# EAGLE design Qwiic_Switch-Gap-0.0320 (EAGLE 9.4.0)
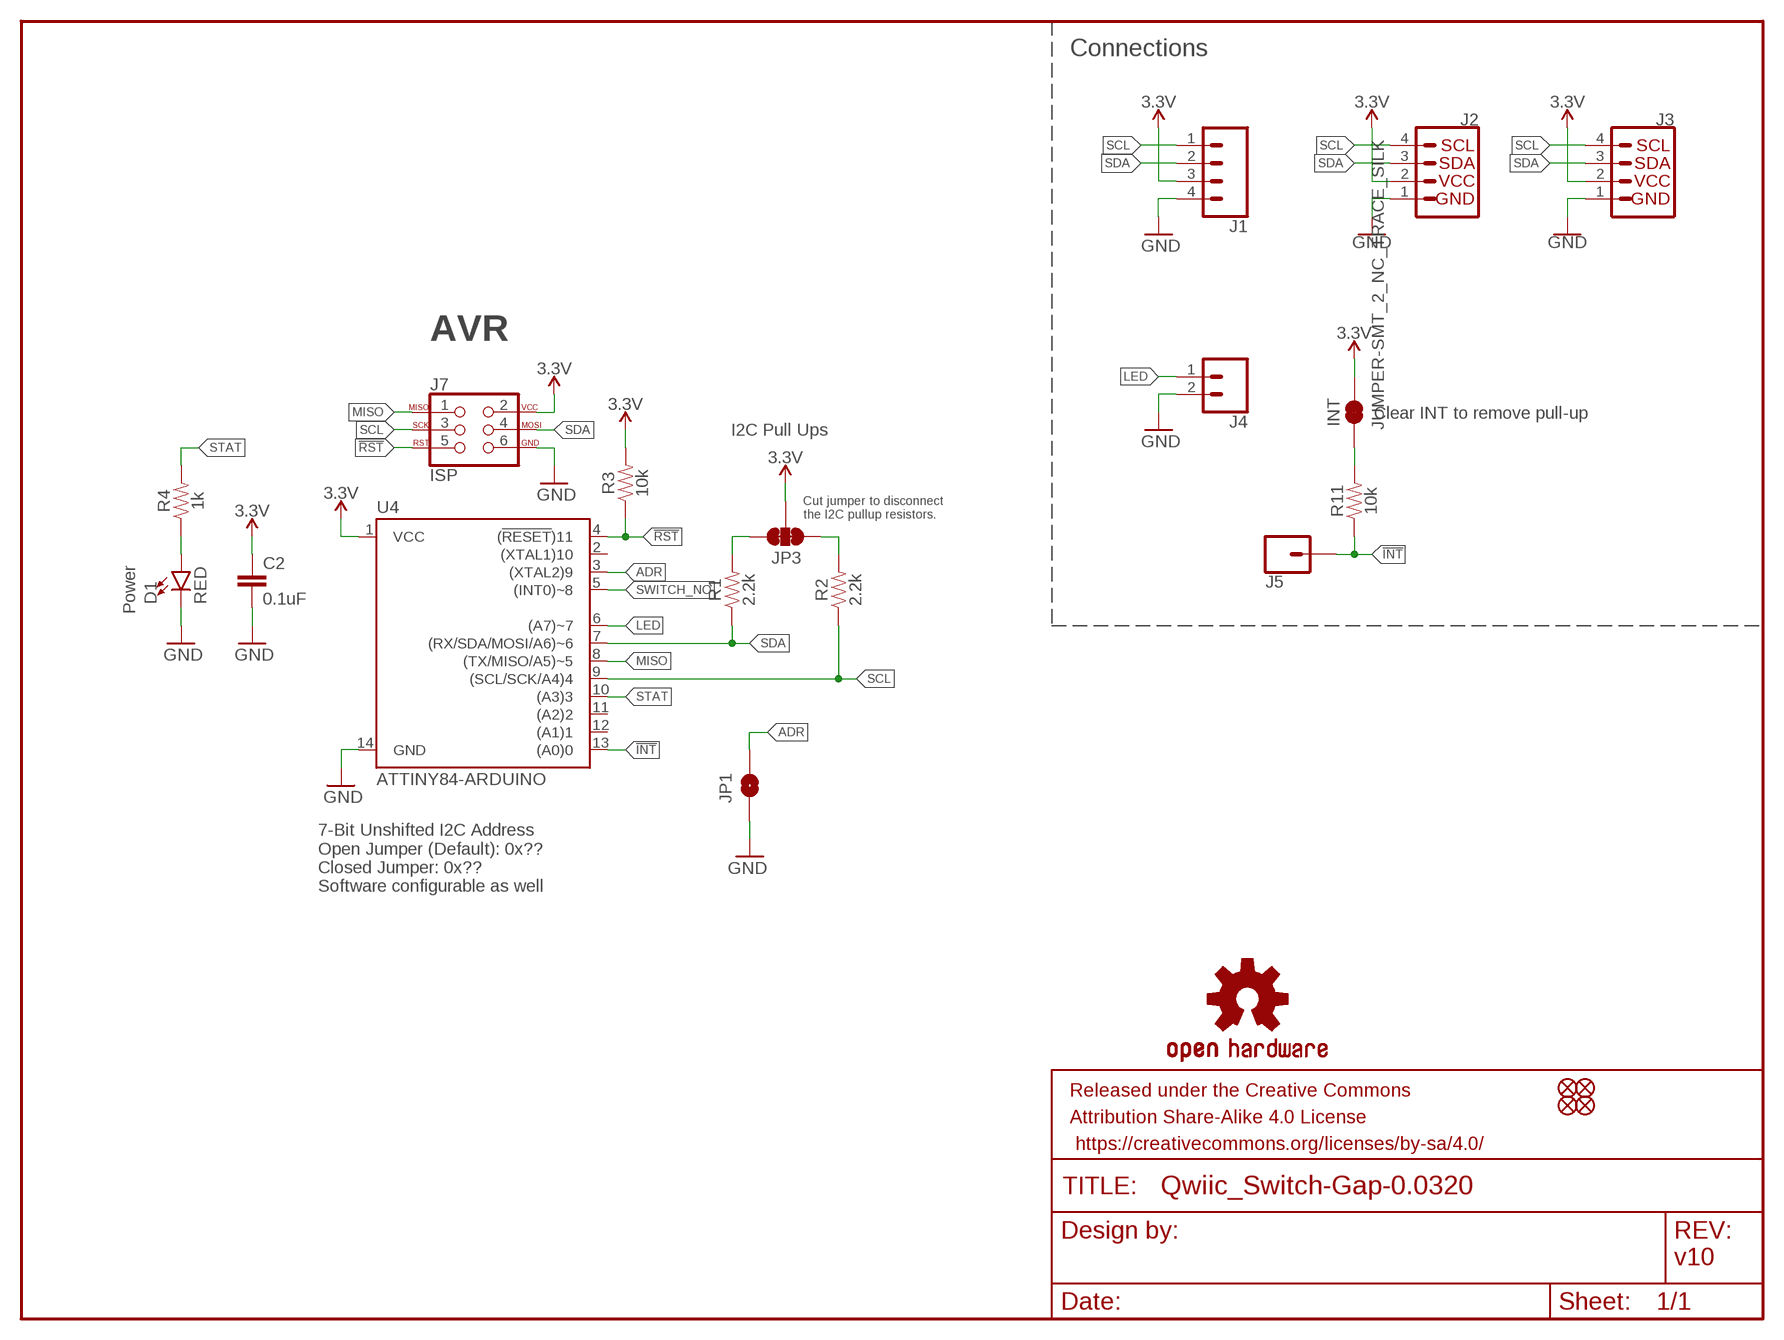
[diagram p0: schematic, sheet 1]

## Parts
C2  0.1uF  0.1UF-0603-25V-(+80/-20%)  [0603]
D1  RED  LED-RED0603  [LED-0603]
FRAME1  FRAME-LETTER  [CREATIVE_COMMONS]
INT  JUMPER-SMT_2_NC_TRACE_SILK  [SMT-JUMPER_2_NC_TRACE_SILK]
J1  CONN_041X04_NO_SILK  [1X04_NO_SILK]
J2  QWIIC_CONNECTORJS-1MM  [JST04_1MM_RA]
J3  QWIIC_CONNECTORJS-1MM  [JST04_1MM_RA]
J4  CONN_021X02_NO_SILK  [1X02_NO_SILK]
J5  CONN_01PTH_NO_SILK_YES_STOP  [1X01_NO_SILK]
J7  ISP  AVR_SPI_PROG_3X2TESTPOINTS  [2X3_TEST_POINTS]
JP1  JUMPER-SMT_2_NO_SILK  [SMT-JUMPER_2_NO_SILK]
JP2  FIDUCIALUFIDUCIAL  [MICRO-FIDUCIAL]
JP3  JUMPER-SMT_3_2-NC_TRACE_SILK  [SMT-JUMPER_3_2-NC_TRACE_SILK]
JP6  FIDUCIALUFIDUCIAL  [MICRO-FIDUCIAL]
JP8  FIDUCIALUFIDUCIAL  [MICRO-FIDUCIAL]
JP9  FIDUCIALUFIDUCIAL  [MICRO-FIDUCIAL]
LOGO1  OSHW-LOGOMINI  [OSHW-LOGO-MINI]
R1  2.2k  2.2KOHM-0603-1/10W-1%  [0603]
R2  2.2k  2.2KOHM-0603-1/10W-1%  [0603]
R3  10k  10KOHM-0603-1/10W-1%  [0603]
R4  1k  1KOHM-0603-1/10W-1%  [0603]
R11  10k  10KOHM-0603-1/10W-1%  [0603]
U4  ATTINY84-ARDUINO  [SO14]

## Nets
3.3V: C2.1 INT.2 J1.3 J2.2 J3.2 J7.2 JP3.2 R3.2 U4.1(VCC)
!INT: J5.1 R11.1 U4.13((A0)0)
!RST: J7.5 R3.1 U4.4((!RESET!)11)
ADR: JP1.2 U4.3((XTAL2)9)
GND: C2.2 D1.C J1.4 J2.1 J3.1 J4.2 J7.6 JP1.1 U4.14(GND)
INT_R: INT.1 R11.2
LED: J4.1 U4.6((A7)~7)
MISO: J7.1 U4.8((TX/MISO/A5)~5)
N$3: D1.A R4.1
SCL: J1.1 J2.4 J3.4 J7.3 R2.1 U4.9((SCL/SCK/A4)4)
SCL_PU1: JP3.1 R2.2
SDA: J1.2 J2.3 J3.3 J7.4 R1.1 U4.7((RX/SDA/MOSI/A6)~6)
SDA_PU1: JP3.3 R1.2
STAT: R4.2 U4.10((A3)3)
SWITCH_NO: U4.5((INT0)~8)
Unconnected: U4.2((XTAL1)10) U4.11((A2)2) U4.12((A1)1)

## Notes on the sheet
- Connections
- AVR
- Clear INT to remove pull-up
- I2C Pull Ups
- Cut jumper to disconnect
  the I2C pullup resistors.
- Power
- 7-Bit Unshifted I2C Address
  Open Jumper (Default): 0x??
  Closed Jumper: 0x??
  Software configurable as well
- v10

## Library data of the parts
C2 = SparkFun-Capacitors:0.1UF: 0.1µF ceramic capacitors A capacitor is a passive two-terminal electrical component used to store electrical energy temporarily in an electric field.; PROD_ID: CAP-00810
D1 = SparkFun-LED:LED-RED: Red SMD LED Used in manufacturing of most products at SparkFun Packages: 0603 - SMD 0603 package [Product Link] <http://docs.avagotech.com/docs/AV02-0551EN> 0603 SMART - SMD 0603 SMART package ( more efficient and expensive)[Product Link] <http://www.osram-os.com/Graphics/XPic2/00077099_0.pdf> 1206 - SMD1206 package [Product Link] <https://www.sparkfun.com/datasheets/DevTools/LilyPad/Q150OVS4.pdff> SparkFun Products: Pro Mini 328 -5V <https://www.sparkfun.com/products/821> RedBoard <https://www.sparkfun.com/products/12757> IOIO-OTG <https://www.sparkfun.com/products/13613>; PROD_ID: DIO-00819
FRAME1 = SparkFun-Aesthetics:FRAME-LETTER: Schematic Frame - Letter Standard 8.5x11 US Letter frame
INT = SparkFun-Jumpers:JUMPER-SMT_2_NC_TRACE: Normally closed trace jumper This jumper has a trace between two pads so it's normally closed (NC). Use a razor knife to open the connection. For best results follow the IPC guidelines for cutting traces: Cutout at least 0.063 mm (0.005 in). Remove all loose material to clean up the cut area. Seal the cut with an approved epoxy. Reapply solder to reclose the connection.
J1 = SparkFun-Connectors:CONN_04: Multi connection point. Often used as Generic Header-pin footprint for 0.1 inch spaced/style header connections On any of the 0.1 inch spaced packages, you can populate with these: Break Away Headers - Straight <https://www.sparkfun.com/products/116> (PRT-00116) Break Away Male Headers - Right Angle <https://www.sparkfun.com/products/553> (PRT-00553) Female Headers <https://www.sparkfun.com/products/115> (PRT-00115) Break Away Headers - Machine Pin <https://www.sparkfun.com/products/117> (PRT-00117) Break Away Female Headers - Swiss Machine Pin <https://www.sparkfun.com/products/743> (PRT-00743) For SCREWTERMINALS and SPRING TERMINALS visit here: Screw Terimnals on SparkFun.com <https://www.sparkfun.com/search/results?term=Screw+Terminals> (5mm/3.5mm/2.54mm spacing) This device is also useful as a general connection point to wire up your design to another part of your project. Our various solder wires solder well into these plated through hole pads. Hook-Up Wire - Assortment (Stranded, 22 AWG) <https://www.sparkfun.com/products/11375> (PRT-11375) Hook-Up Wire - Assortment (Solid Core, 22 AWG) <https://www.sparkfun.com/products/11367> (PRT-11367) View the entire wire category on our website here <https://www.sparkfun.com/categories/141> Special notes: Molex polarized connector foot print use with SKU : PRT-08231 with associated crimp pins and housings. 1MM SMD Version SKU: PRT-10208; PROD_ID: CONN-09696
J2 J3 = SparkFun-Connectors:QWIIC_CONNECTOR: SparkFun I2C Standard Qwiic Connector An SMD 1mm pitch JST connector makes it easy and quick (get it? Qwiic?) to connect I2C devices to each other. The Qwiic system <http://www.sparkfun.com/qwiic> enables fast and solderless connection between popular platforms and various sensors and actuators. We carry 200mm <https://www.sparkfun.com/products/14204>, 100mm <https://www.sparkfun.com/products/14205>, 50mm <https://www.sparkfun.com/products/14206>, and breadboard friendly <https://www.sparkfun.com/products/14207> Qwiic cables. We also offer 10 pcs strips <https://www.sparkfun.com/products/14323> the SMD connectors.; PROD_ID: CONN-13694
J4 = SparkFun-Connectors:CONN_02: Multi connection point. Often used as Generic Header-pin footprint for 0.1 inch spaced/style header connections On any of the 0.1 inch spaced packages, you can populate with these: Break Away Headers - Straight <https://www.sparkfun.com/products/116> (PRT-00116) Break Away Male Headers - Right Angle <https://www.sparkfun.com/products/553> (PRT-00553) Female Headers <https://www.sparkfun.com/products/115> (PRT-00115) Break Away Headers - Machine Pin <https://www.sparkfun.com/products/117> (PRT-00117) Break Away Female Headers - Swiss Machine Pin <https://www.sparkfun.com/products/743> (PRT-00743) For SCREWTERMINALS and SPRING TERMINALS visit here: Screw Terimnals on SparkFun.com <https://www.sparkfun.com/search/results?term=Screw+Terminals> (5mm/3.5mm/2.54mm spacing) This device is also useful as a general connection point to wire up your design to another part of your project. Our various solder wires solder well into these plated through hole pads. Hook-Up Wire - Assortment (Stranded, 22 AWG) <https://www.sparkfun.com/products/11375> (PRT-11375) Hook-Up Wire - Assortment (Solid Core, 22 AWG) <https://www.sparkfun.com/products/11367> (PRT-11367) View the entire wire category on our website here <https://www.sparkfun.com/categories/141> Special notes: Molex polarized connector foot print use with: PRT-08233 with associated crimp pins and housings. 2.54_SCREWTERM for use with PRT-10571. 3.5mm Screw Terminal footprints for PRT-08084 5mm Screw Terminal footprints for use with PRT-08432
J5 = SparkFun-Connectors:CONN_01: Single connection point. Often used as Generic Header-pin footprint for 0.1 inch spaced/style header connections On any of the 0.1 inch spaced packages, you can populate with these: Break Away Headers - Straight <https://www.sparkfun.com/products/116> (PRT-00116) Break Away Male Headers - Right Angle <https://www.sparkfun.com/products/553> (PRT-00553) Female Headers <https://www.sparkfun.com/products/115> (PRT-00115) Break Away Headers - Machine Pin <https://www.sparkfun.com/products/117> (PRT-00117) Break Away Female Headers - Swiss Machine Pin <https://www.sparkfun.com/products/743> (PRT-00743) This device is also useful as a general connection point to wire up your design to another part of your project. Our various solder wires solder well into these plated through hole pads. Hook-Up Wire - Assortment (Stranded, 22 AWG) <https://www.sparkfun.com/products/11375> (PRT-11375) Hook-Up Wire - Assortment (Solid Core, 22 AWG) <https://www.sparkfun.com/products/11367> (PRT-11367) View the entire wire category on our website here <https://www.sparkfun.com/categories/141> Special notes: SMTSO-256-ET is a "flush mount" nut for a 4-40 screw. We mostly use this on specialty testbeds; it is a nice way to connect hardware to your PCB at an adjustable hieght. Also note, the SNAP packages are for using a snappable style connector. We sell a baggie of snaps and they are also used on two LilyPad designs: Snap Assortment - 30 pack (male and female) <https://www.sparkfun.com/products/11347> (DEV-11347) LilyPad Arduino SimpleSnap <https://www.sparkfun.com/products/10941> (DEV-10941) LilyPad SimpleSnap Protoboard <https://www.sparkfun.com/products/10940> (DEV-10940)
J7 = SparkFun-Connectors:AVR_SPI_PROG_3X2: AVR ISP 6 Pin This is the reduced ISP connector for AVR programming. Common on Arduino. This footprint will take up less PCB space and can be used with a 10-pin to 6-pin adapter such as SKU: BOB-08508 **Special note about "TEST_POINT" package. The stop mask is on the top side, so if you want your programming test points to be on the bottom of your board, make sure to place this package on the bottom side of the board. This also ensure that the orientation to program from the bottom side will be correct. SparkFun Products: SparkFun ISP Pogo Adapter <https://www.sparkfun.com/products/11591> - NS Tiny AVR Programmer <https://www.sparkfun.com/products/11801> -PTH
JP1 = SparkFun-Jumpers:JUMPER-SMT_2_NO: Normally open jumper This jumper has two pads in close proximity to each other. Apply solder to close the connection. Round pads are easier to solder for beginners, but are a lot larger. SparkFun Product that uses the round pads: SparkFun EL Sequencer <https://www.sparkfun.com/products/12781>
JP2 JP6 JP8 JP9 = SparkFun:FIDUCIAL: Fiducial Alignment Points Various fiducial points for machine vision alignment.
JP3 = SparkFun-Jumpers:JUMPER-SMT_3_2-NC_TRACE: Normally closed trace jumper (2 of 2 connections) This jumper has a trace between all three pads so they are normally closed (NC). Use a razor knife to open the connection(s). For best results follow the IPC guidelines for cutting traces: Cutout at least 0.063 mm (0.005 in). Remove all loose material to clean up the cut area. Seal the cut with an approved epoxy. Reapply solder to reclose the connection(s).
LOGO1 = SparkFun-Aesthetics:OSHW-LOGO: Open-Source Hardware (OSHW) Logo This logo indicates the piece of hardware it is found on incorporates a OSHW license and/or adheres to the definition of open source hardware found here: http://freedomdefined.org/OSHW
R1 R2 = SparkFun-Resistors:2.2KOHM: 2.2kΩ resistor A resistor is a passive two-terminal electrical component that implements electrical resistance as a circuit element. Resistors act to reduce current flow, and, at the same time, act to lower voltage levels within circuits. - Wikipedia; PROD_ID: RES-08272
R3 R11 = SparkFun-Resistors:10KOHM: 10kΩ resistor A resistor is a passive two-terminal electrical component that implements electrical resistance as a circuit element. Resistors act to reduce current flow, and, at the same time, act to lower voltage levels within circuits. - Wikipedia; PROD_ID: RES-00824
R4 = SparkFun-Resistors:1KOHM: 1kΩ resistor A resistor is a passive two-terminal electrical component that implements electrical resistance as a circuit element. Resistors act to reduce current flow, and, at the same time, act to lower voltage levels within circuits. - Wikipedia; PROD_ID: RES-07856
U4 = SparkFun-IC-Microcontroller:ATTINY84-ARDUINO; PROD_ID: IC-14155

## Board
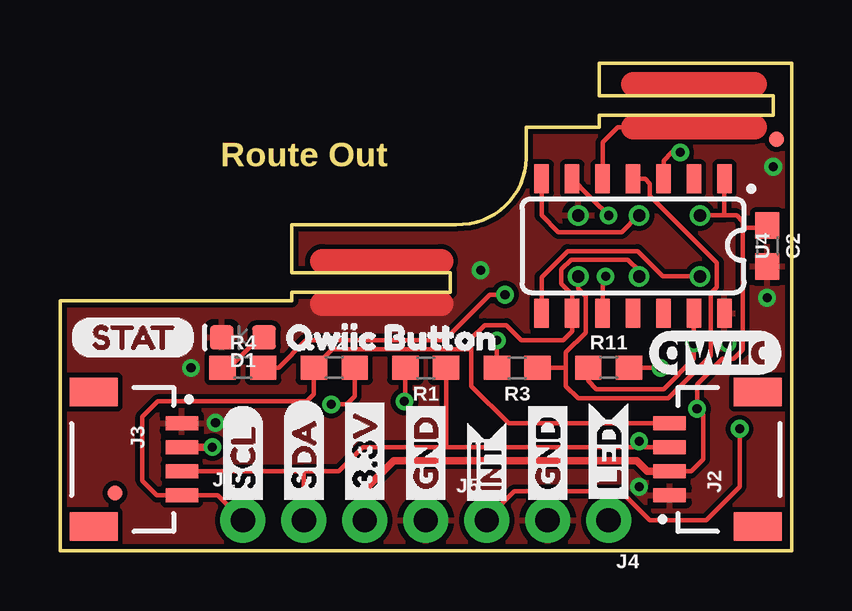
[diagram p1: board, top side]
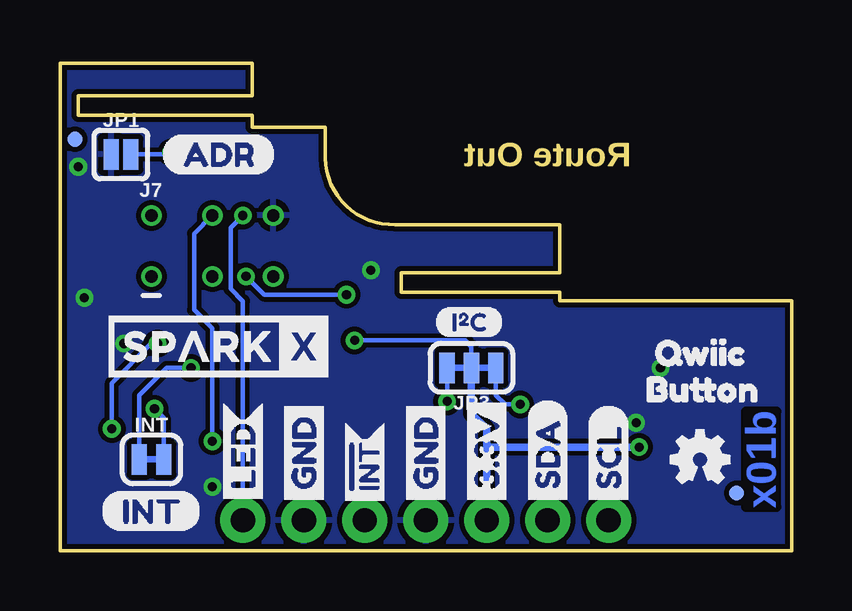
[diagram p2: board, bottom side, seen from below]

Size 30.48 x 20.32 mm. Coordinates in mm from the lower left corner, seen from the top.
Outline: 0,0 30.48,0 30.48,20.32 22.48,20.32 22.48,18.95 29.72,18.95 29.72,18.14 22.48,18.14 22.48,17.65 19.43,17.65 19.43,16.64 arc-96 16.51,13.59 9.65,13.59 9.65,11.58 16.26,11.58 16.26,10.77 9.65,10.77 9.65,10.41 0,10.41 0,0
Copper layers (1*16): Top 0.035mm / dielectric 1.5mm / Bottom 0.035mm
Design rules "SparkFun-2-layer-TIGHT": minimum track width 7mil, minimum drill 15mil, track to track 7mil, track to pad 7mil, pad to pad 7mil, via to via 7mil, smd to smd 7mil, copper to edge 7mil, drill to drill 7mil, minimum pad ring 7mil, minimum via ring 7mil, stop-mask expansion 4mil, vias tented up to drill 25mil, thermal gap 10mil

### Footprints (pad centres in the part's own frame; a part is rotated, then mirrored left to right if it is on the bottom)
0603 = smd 1.1 x 1: 1 -0.85,0; 2 0.85,0
LED-0603 = smd 1 x 1: A -0.877,0; C 0.877,0
SMT-JUMPER_2_NC_TRACE_SILK = smd 0.635 x 1.27: 1 -0.508,0; 2 0.508,0
1X04_NO_SILK = drill 1.016 pad 1.88: 1 0,0; 2 2.54,0; 3 5.08,0; 4 7.62,0
JST04_1MM_RA = smd 0.6 x 1.35: 1 -1.5,0; 2 -0.5,0; 3 0.5,0; 4 1.5,0 | smd 1.2 x 2: NC1 2.8,-3.675; NC2 -2.8,-3.675
1X02_NO_SILK = drill 1.016 pad 1.88: 1 0,0; 2 2.54,0
1X01_NO_SILK = drill 1.016 pad 1.88: 1 0,0
2X3_TEST_POINTS = drill 0.508: 1 -2.54,-1.27; 2 -2.54,1.27; 3 0,-1.27; 4 0,1.27; 5 2.54,-1.27; 6 2.54,1.27
SMT-JUMPER_2_NO_SILK = smd 0.635 x 1.27: 1 -0.406,0; 2 0.406,0
MICRO-FIDUCIAL = smd 0.635 x 0.635: 1 0,0
SMT-JUMPER_3_2-NC_TRACE_SILK = smd 0.635 x 1.27: 1 -1.016,0; 2 0,0; 3 1.016,0
SO14 = smd 0.6 x 1.2: 1 -3.175,-2.8; 2 -1.905,-2.8; 3 -0.635,-2.8; 4 0.635,-2.8; 5 1.905,-2.8; 6 3.175,-2.8; 7 4.445,-2.8; 8 4.445,2.8; 9 3.175,2.8; 10 1.905,2.8; 11 0.635,2.8; 12 -0.635,2.8; 13 -1.905,2.8; 14 -3.175,2.8

### Placement (x,y rotation side)
C2  29.46,12.7 270 top
D1  7.62,8.89 180 top
FRAME1  -7.62,-21.59 0 top  (outside the outline)
INT  26.67,3.81 0 bottom
J1  7.62,1.27 0 top
J2  25.4,3.81 90 top
J3  5.08,3.81 270 top
J4  22.86,1.27 180 top
J5  17.78,1.27 0 top
J7  24.13,12.7 0 bottom
JP1  27.94,16.51 0 bottom
JP2  29.84,17.14 0 bottom
JP3  13.34,7.62 180 bottom
JP6  2.29,2.41 0 bottom
JP8  2.29,2.41 0 top
JP9  29.84,17.14 0 top
LOGO1  3.81,3.81 0 bottom
R1  15.24,7.62 180 top
R2  11.43,7.62 0 top
R3  19.05,7.62 180 top
R4  7.62,7.62 0 top
R11  22.86,7.62 0 top
U4  24.51,12.7 180 top
U$1  [BUTTON1]  12.57,8.89 0 top
U$2  [QWIIC0]  8.51,8.89 0 top
U$3  [LED2]  22.86,1.65 90 top
U$4  [INT-()-04]  28.83,1.65 0 bottom
U$5  [SCL]  7.62,1.65 90 bottom
U$6  [SDA]  10.16,1.65 90 bottom
U$7  [3.3V]  12.7,1.65 90 bottom
U$8  [GND]  15.24,1.65 90 bottom
U$9  [(ADR)]  26.29,16.51 0 bottom
U$10  [I_SUPER2_C-()-03]  14.86,9.53 0 bottom
U$11  [INT#-[<-04]  17.78,1.4 90 top
U$12  [SDA]  10.16,1.65 90 top
U$13  [GND]  15.24,1.65 90 top
U$14  [SCL]  7.62,1.65 90 top
U$15  [INT#-[<-04]  17.78,1.4 90 bottom
U$16  [GND]  20.32,1.65 90 top
U$17  [GND]  20.32,1.65 90 bottom
U$18  [SPARKX-MEDIUM]  23.88,8.51 0 bottom
U$19  [LED2]  22.86,1.65 90 bottom
U$20  [QWIIC0]  6.6,8.26 0 bottom
U$21  [STAT1]  0.38,8.89 0 top
U$22  [3.3V]  12.7,1.65 90 top
U$23  [BUTTON1]  6.99,6.73 0 bottom
U$24  [QWIIC_5.5MM]  27.3,8.26 0 top

### Tracks (layer width: path | path; a pad name or v marks a point on that pad's centre or on a via)
3.3V  (via drill 0.38)
  Top 0.178: J2.2 26.3,3.31 26.8,3.81 26.8,5.66 v26.54,5.91 26.54,6.94 27.6,8 28.08,8 28.45,8.37 28.45,13.46 | U4.1 27.69,13.97 | J7.2 27.69,13.97 | 28.45,13.46 28.45,13.72 28.19,13.97 27.69,13.97 | C2.1 29.38,13.46 28.45,13.46 | R3.2 v18.2,8.76
  Top 0.305: J1.3 12.7,2.54 13.91,3.75 24.04,3.75 24.48,3.31 J2.2 | J3.2 v6.34,4.31 v6.35,4.32
  Bottom 0.178: v26.54,5.91 26.16,5.53 INT.2 | JP3.2 13.34,8.51 13.59,8.76 v18.2,8.76
  Bottom 0.305: J1.3 12.7,4.32 | 12.7,4.32 12.7,5.08 13.34,5.71 JP3.2 | v6.35,4.32 12.7,4.32
!INT  (via drill 0.38)
  Top 0.178: J5.1 17.78,1.32 18.93,2.48 23.36,2.48 24.57,1.27 26.92,1.27 28.32,2.67 v28.32,5.08 | R11.1 22.01,7.07 22.35,6.73 25.15,6.73 26.42,8 v26.42,8.64 U4.13
  Bottom 0.178: v28.32,5.08 28.32,6.99 26.67,8.64 v26.42,8.64
!RST
  Top 0.178: J7.5 21.59,10.92 21.9,10.61 21.9,9.08 21.08,8.26 21.08,7.62 | U4.4 24.38,15.5 24.58,15.3 24.58,14.79 27.37,12 27.37,10.99 27.11,10.73 27.11,8.12 25.34,6.35 21.59,6.35 21.08,6.86 21.08,7.62 | R3.1 21.08,7.62
ADR  (via drill 0.38)
  Top 0.178: v25.84,16.6 25.49,16.6 25.15,16.26 U4.3
  Bottom 0.178: JP1.2 25.93,16.51 v25.84,16.6
GND  (via drill 0.38)
  Top 1.016: 10.92,10.29 15.88,10.29
  other vias: 29.46,10.54 29.72,16 5.46,7.62 6.48,5.33 24.13,2.67 27.81,8.64 17.53,11.68
  pour Top (isolate 0.203): 0,0 0,20.32 30.48,20.32 30.48,0
  pour Bottom (isolate 0.203): 0,0 30.48,0 30.48,20.32 0,20.32
INT_R  (via drill 0.38)
  Top 0.178: v25.02,7.62 R11.2
  Bottom 0.178: INT.1 27.18,6.48 26.04,7.62 v25.02,7.62
LED  (via drill 0.38)
  Top 0.178: v22.86,13.97 22.2,14.63 22.04,14.79 22.04,14.8 U4.6
  Bottom 0.178: J4.1 22.86,10.4 23.37,10.91 23.37,13.46 v22.86,13.97
MISO
  Top 0.178: J7.1 25.12,11.43 24.06,12.48 21.15,12.48 20.07,11.4 U4.8
N$1
  Top 1.016: 23.88,19.43 28.96,19.43
N$3
  Top 0.178: R4.1 7.04,7.62 8.31,8.89 D1.A
N$6
  Top 1.016: 10.92,12.06 15.88,12.06
SCL
  Top 0.178: J1.1 6.58,2.31 J3.4 4.04,2.31 3.43,2.92 3.43,5.59 4.06,6.22 10.29,6.22 10.58,6.52 R2.1 11.35,8.39 17.14,8.39 17.14,8.38 | J7.3 24.13,11.66 23.66,12.13 21.3,12.13 20.89,11.72 20.89,11.12 21.34,10.67 U4.9 21.34,9.14 20.96,8.77 19.23,8.77 18.59,9.4 17.69,9.4 17.14,8.86 17.14,8.38 | J2.4 18.69,5.31 17.14,6.86 17.14,8.38
SCL_PU1  (via drill 0.38)
  Top 0.178: v11.3,6.1 11.94,6.1 12.28,6.44 R2.2
  Bottom 0.178: JP3.1 12.32,6.48 11.94,6.1 v11.3,6.1
SDA  (via drill 0.38)
  Top 0.178: J2.3 24.38,4.31 v24.13,4.56 23.88,4.32 16.13,4.32 | J7.4 24.1,13.97 23.4,13.27 20.77,13.27 20.07,13.97 U4.7 | J3.3 10.16,3.31 | 10.16,3.31 11.61,3.31 12.62,4.32 16.13,4.32 | J1.2 10.16,3.31 | R1.1 16.09,4.36 16.13,4.32
  Bottom 0.178: J7.4 24.89,13.21 24.89,10.03 24.13,9.27 v24.13,4.56
SDA_PU1  (via drill 0.38)
  Top 0.178: R1.2 14.39,6.26 v14.35,6.22
  Bottom 0.178: v14.35,6.22 JP3.3
STAT  (via drill 0.38)
  Top 0.178: R4.2 9.11,7.62 10.25,8.76 16,8.76 17.91,10.67 v18.54,10.67 | v22.73,11.43 22.61,11.3 U4.10
  Bottom 0.178: v22.73,11.43 21.97,10.67 v18.54,10.67
SWITCH_NO
  Top 0.178: U4.5 22.61,17.02 23.24,17.65 23.88,17.65
  Top 1.016: 23.88,17.65 28.96,17.65

### Text on the board
Bottom: x01b
Milling: Route Out